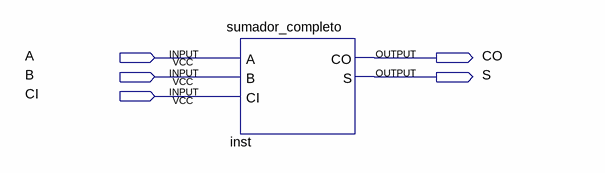
[diagram p0: schematic sheet]
// Quartus schematic Block1.bdf as structural Verilog: 1 symbols, 5 pins
module Block1 (
  input  A,
  input  B,
  input  CI,
  output CO,
  output S
);

  sumador_completo inst (.A(A), .B(B), .CI(CI), .CO(CO), .S(S));
endmodule
